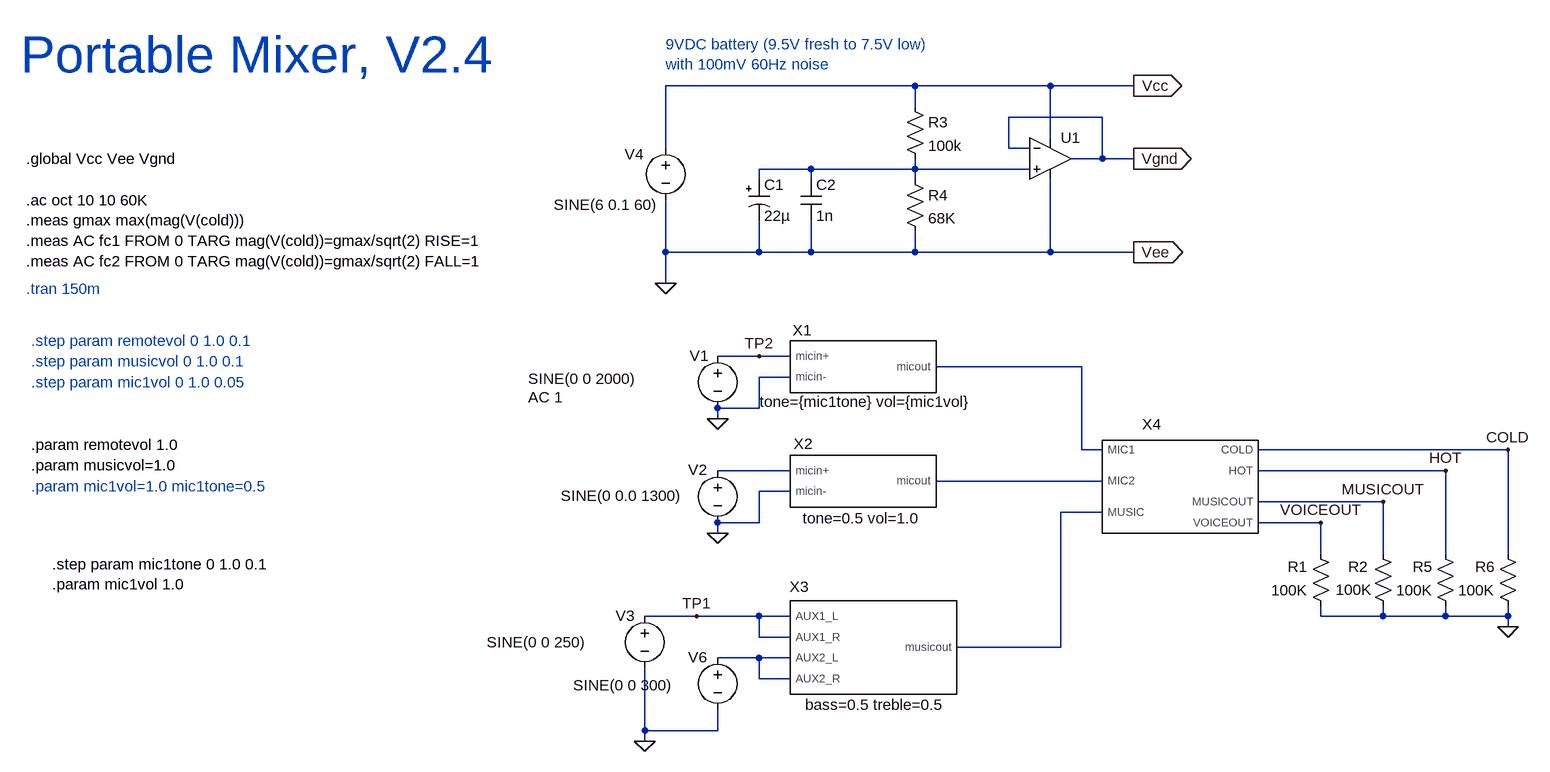
[diagram p0: schematic NewTopLevel_V2.4.asc]
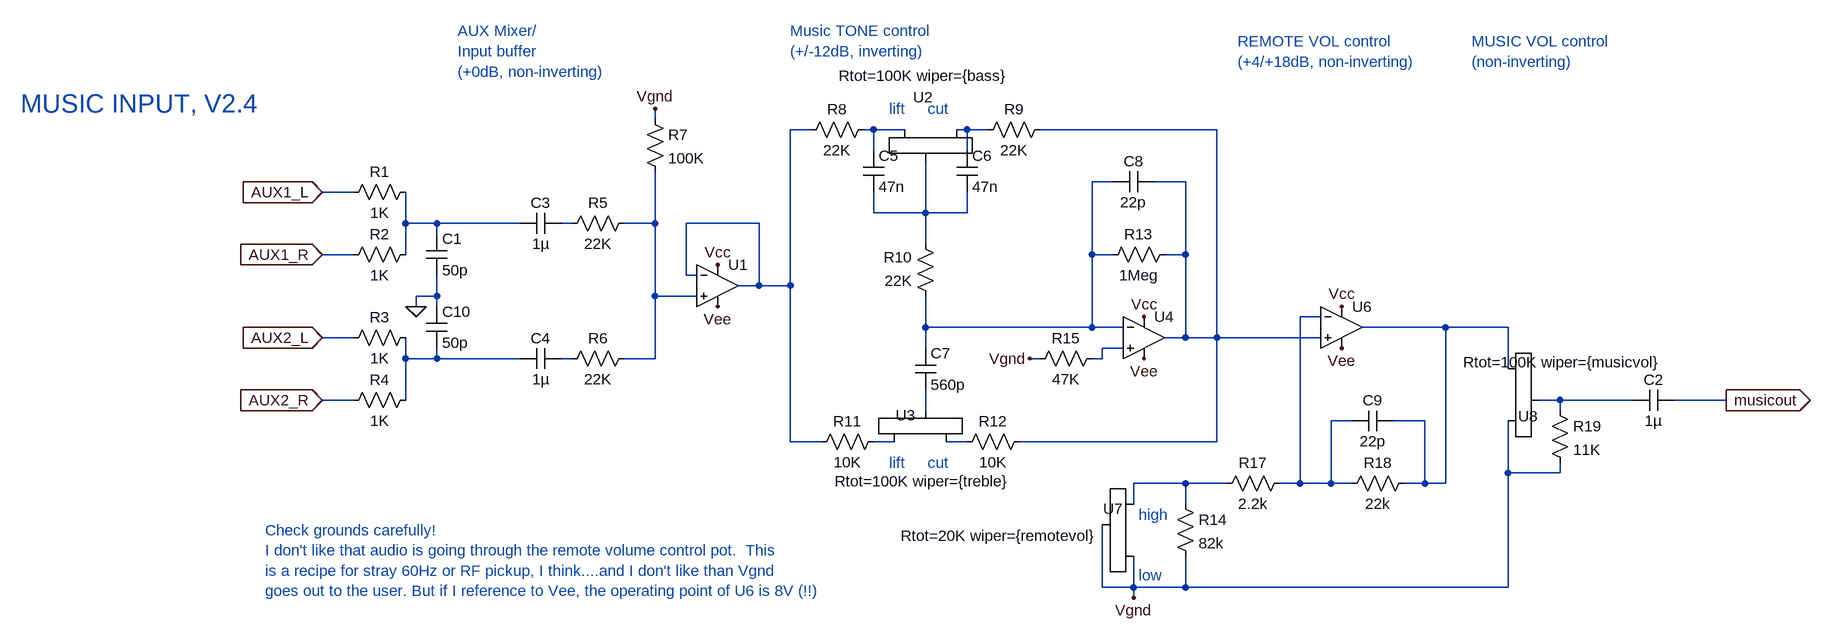
[diagram p1: sub-circuit newmusicinput_v2.4.asc]
NewTopLevel_V2.4.asc, the LTspice schematic file:
Version 4
SHEET 1 1264 812
WIRE 224 -256 -160 -256
WIRE 432 -256 224 -256
WIRE 560 -256 432 -256
WIRE 224 -224 224 -256
WIRE 512 -208 368 -208
WIRE 432 -176 432 -256
WIRE -160 -160 -160 -256
WIRE 368 -160 368 -208
WIRE 400 -160 368 -160
WIRE 512 -144 512 -208
WIRE 512 -144 464 -144
WIRE 560 -144 512 -144
WIRE 64 -128 -16 -128
WIRE 224 -128 224 -144
WIRE 224 -128 64 -128
WIRE 400 -128 224 -128
WIRE -16 -112 -16 -128
WIRE 64 -112 64 -128
WIRE 224 -112 224 -128
WIRE -160 0 -160 -80
WIRE -16 0 -16 -48
WIRE -16 0 -160 0
WIRE 64 0 64 -48
WIRE 64 0 -16 0
WIRE 224 0 224 -32
WIRE 224 0 64 0
WIRE 432 0 432 -112
WIRE 432 0 224 0
WIRE 560 0 432 0
WIRE -160 48 -160 0
WIRE -16 160 -80 160
WIRE 32 160 -16 160
WIRE 480 176 256 176
WIRE 32 192 -16 192
WIRE -16 240 -16 192
WIRE -16 240 -80 240
WIRE -80 256 -80 240
WIRE 480 304 480 176
WIRE 512 304 480 304
WIRE 1136 304 752 304
WIRE 32 336 -80 336
WIRE 1040 336 752 336
WIRE 512 352 256 352
WIRE 32 368 -16 368
WIRE 944 384 752 384
WIRE 512 400 448 400
WIRE -16 416 -16 368
WIRE -16 416 -80 416
WIRE 848 416 752 416
WIRE -80 432 -80 416
WIRE 848 464 848 416
WIRE 944 464 944 384
WIRE 1040 464 1040 336
WIRE 1136 464 1136 304
WIRE -112 560 -192 560
WIRE -16 560 -112 560
WIRE 32 560 -16 560
WIRE 848 560 848 544
WIRE 944 560 944 544
WIRE 944 560 848 560
WIRE 1040 560 1040 544
WIRE 1040 560 944 560
WIRE 1136 560 1136 544
WIRE 1136 560 1040 560
WIRE 1136 576 1136 560
WIRE -16 592 -16 560
WIRE 32 592 -16 592
WIRE 448 608 448 400
WIRE 448 608 288 608
WIRE -16 624 -80 624
WIRE 32 624 -16 624
WIRE -16 656 -16 624
WIRE 32 656 -16 656
WIRE -192 736 -192 640
WIRE -80 736 -80 704
WIRE -80 736 -192 736
WIRE -192 752 -192 736
FLAG -80 256 0
FLAG -80 432 0
FLAG 560 -144 Vgnd
IOPIN 560 -144 Out
FLAG 560 -256 Vcc
IOPIN 560 -256 Out
FLAG 560 0 Vee
IOPIN 560 0 Out
FLAG -160 48 0
FLAG -192 752 0
FLAG 1136 576 0
FLAG 1136 304 COLD
FLAG 1040 336 HOT
FLAG 944 384 MUSICOUT
FLAG 848 416 VOICEOUT
FLAG -112 560 TP1
FLAG -16 160 TP2
SYMBOL NewBalancedMicInput_V2.4 144 176 R0
WINDOW 0 -94 -40 Bottom 2
WINDOW 39 4 70 Bottom 2
SYMATTR InstName X1
SYMATTR SpiceLine tone={mic1tone} vol={mic1vol}
SYMBOL NewBalancedMicInput_V2.4 144 352 R0
WINDOW 0 -92 -42 Bottom 2
WINDOW 39 -3 73 Bottom 2
SYMATTR InstName X2
SYMATTR SpiceLine tone=0.5 vol=1.0
SYMBOL voltage -80 144 R0
WINDOW 0 -43 15 Left 2
WINDOW 3 -291 51 Left 2
WINDOW 123 -291 79 Left 2
WINDOW 39 0 0 Left 0
SYMATTR InstName V1
SYMATTR Value SINE(0 0 2000)
SYMATTR Value2 AC 1
SYMBOL voltage -80 320 R0
WINDOW 0 -45 15 Left 2
WINDOW 3 -241 55 Left 2
WINDOW 123 -241 83 Left 2
WINDOW 39 0 0 Left 0
SYMATTR InstName V2
SYMATTR Value SINE(0 0.0 1300)
SYMBOL UniversalOpamp 432 -144 R0
SYMATTR InstName U1
SYMATTR Value2 Avol=100K GBW=1.2Meg Vos=0
SYMBOL Res 208 -240 R0
SYMATTR InstName R3
SYMATTR Value 100k
SYMBOL Res 208 -128 R0
SYMATTR InstName R4
SYMATTR Value 68K
SYMBOL voltage -160 -176 R0
WINDOW 123 0 0 Left 0
WINDOW 39 0 0 Left 0
WINDOW 0 -63 25 Left 2
WINDOW 3 -172 103 Left 2
SYMATTR InstName V4
SYMATTR Value SINE(6 0.1 60)
SYMBOL Cap 48 -112 R0
SYMATTR InstName C2
SYMATTR Value 1n
SYMBOL polcap -32 -112 R0
SYMATTR InstName C1
SYMATTR Value 22µ
SYMBOL NewMusicInput_V2.4 160 608 R0
WINDOW 0 -114 -78 Bottom 2
WINDOW 39 2 104 Bottom 2
SYMATTR InstName X3
SYMATTR SpiceLine bass=0.5 treble=0.5
SYMBOL voltage -192 544 R0
WINDOW 0 -45 15 Left 2
WINDOW 3 -243 56 Left 2
WINDOW 123 -243 84 Left 2
WINDOW 39 0 0 Left 0
SYMATTR InstName V3
SYMATTR Value SINE(0 0 250)
SYMBOL voltage -80 608 R0
WINDOW 0 -45 15 Left 2
WINDOW 3 -222 58 Left 2
WINDOW 123 0 0 Left 0
WINDOW 39 0 0 Left 0
SYMATTR InstName V6
SYMATTR Value SINE(0 0 300)
SYMBOL NewFinalMixer_V2.4 624 352 R0
SYMATTR InstName X4
SYMBOL res 864 560 R180
WINDOW 0 36 76 Left 2
WINDOW 3 36 40 Left 2
SYMATTR InstName R1
SYMATTR Value 100K
SYMBOL res 928 448 R0
WINDOW 0 -38 36 Left 2
WINDOW 3 -57 71 Left 2
SYMATTR InstName R2
SYMATTR Value 100K
SYMBOL res 1056 560 R180
WINDOW 0 36 76 Left 2
WINDOW 3 36 40 Left 2
SYMATTR InstName R5
SYMATTR Value 100K
SYMBOL res 1152 560 R180
WINDOW 0 36 76 Left 2
WINDOW 3 36 40 Left 2
SYMATTR InstName R6
SYMATTR Value 100K
TEXT -1144 56 Left 2 ;.tran 150m
TEXT -160 -320 Left 2 ;9VDC battery (9.5V fresh to 7.5V low)\nwith 100mV 60Hz noise
TEXT -1152 -304 Left 6 ;Portable Mixer, V2.4
TEXT -1144 -80 Left 2 !.ac oct 10 10 60K\n.meas gmax max(mag(V(cold)))\n.meas AC fc1 FROM 0 TARG mag(V(cold))=gmax/sqrt(2) RISE=1\n.meas AC fc2 FROM 0 TARG mag(V(cold))=gmax/sqrt(2) FALL=1
TEXT -1136 168 Left 2 ;.step param musicvol 0 1.0 0.1
TEXT -1136 328 Left 2 !.param musicvol=1.0
TEXT -1136 136 Left 2 ;.step param remotevol 0 1.0 0.1
TEXT -1136 296 Left 2 !.param remotevol 1.0
TEXT -1144 -144 Left 2 !.global Vcc Vee Vgnd
TEXT -1136 200 Left 2 ;.step param mic1vol 0 1.0 0.05
TEXT -1136 360 Left 2 ;.param mic1vol=1.0 mic1tone=0.5
TEXT -1104 480 Left 2 !.step param mic1tone 0 1.0 0.1\n.param mic1vol 1.0

newmusicinput_v2.4.asc, the sub-circuit schematic file:
Version 4
SHEET 1 2328 872
WIRE 480 -32 480 -48
WIRE 720 -16 688 -16
WIRE 816 -16 800 -16
WIRE 864 -16 816 -16
WIRE 960 -16 944 -16
WIRE 992 -16 960 -16
WIRE 1344 -16 1072 -16
WIRE 816 16 816 -16
WIRE 960 16 960 -16
WIRE 1184 64 1152 64
WIRE 1296 64 1248 64
WIRE 16 80 -32 80
WIRE 816 112 816 80
WIRE 896 112 896 32
WIRE 896 112 816 112
WIRE 960 112 960 80
WIRE 960 112 896 112
WIRE 96 128 96 80
WIRE 144 128 96 128
WIRE 272 128 144 128
WIRE 352 128 336 128
WIRE 480 128 480 48
WIRE 480 128 432 128
WIRE 640 128 528 128
WIRE 144 144 144 128
WIRE 896 160 896 112
WIRE 16 176 -32 176
WIRE 96 176 96 128
WIRE 1152 176 1152 64
WIRE 1184 176 1152 176
WIRE 1296 176 1296 64
WIRE 1296 176 1264 176
WIRE 528 208 528 128
WIRE 544 208 528 208
WIRE 640 224 640 128
WIRE 640 224 608 224
WIRE 688 224 688 -16
WIRE 688 224 640 224
WIRE 144 240 144 208
WIRE 144 240 112 240
WIRE 480 240 480 128
WIRE 544 240 480 240
WIRE 112 256 112 240
WIRE 144 256 144 240
WIRE 1504 272 1472 272
WIRE 896 288 896 240
WIRE 1152 288 1152 176
WIRE 1152 288 896 288
WIRE 1200 288 1152 288
WIRE 1696 288 1568 288
WIRE 1792 288 1696 288
WIRE 16 304 -32 304
WIRE 1296 304 1296 176
WIRE 1296 304 1264 304
WIRE 1344 304 1344 -16
WIRE 1344 304 1296 304
WIRE 1504 304 1344 304
WIRE 896 320 896 288
WIRE 1200 320 1168 320
WIRE 96 336 96 304
WIRE 144 336 144 320
WIRE 144 336 96 336
WIRE 272 336 144 336
WIRE 352 336 336 336
WIRE 480 336 480 240
WIRE 480 336 432 336
WIRE 1072 336 1056 336
WIRE 1168 336 1168 320
WIRE 1168 336 1152 336
WIRE 1792 352 1792 288
WIRE 16 400 -32 400
WIRE 96 400 96 336
WIRE 1872 400 1840 400
WIRE 1984 400 1872 400
WIRE 2128 400 2048 400
WIRE 896 416 896 384
WIRE 1872 416 1872 400
WIRE 1552 432 1520 432
WIRE 1664 432 1616 432
WIRE 688 464 688 224
WIRE 736 464 688 464
WIRE 848 464 816 464
WIRE 960 464 928 464
WIRE 1344 464 1344 304
WIRE 1344 464 1040 464
WIRE 1792 512 1792 432
WIRE 1872 512 1872 496
WIRE 1872 512 1792 512
WIRE 1296 528 1216 528
WIRE 1360 528 1296 528
WIRE 1472 528 1472 272
WIRE 1472 528 1440 528
WIRE 1520 528 1520 432
WIRE 1520 528 1472 528
WIRE 1552 528 1520 528
WIRE 1664 528 1664 432
WIRE 1664 528 1632 528
WIRE 1696 528 1696 288
WIRE 1696 528 1664 528
WIRE 1216 560 1216 528
WIRE 1296 560 1296 528
WIRE 1168 688 1168 592
WIRE 1216 688 1216 640
WIRE 1216 688 1168 688
WIRE 1296 688 1296 640
WIRE 1296 688 1216 688
WIRE 1792 688 1792 512
WIRE 1792 688 1296 688
WIRE 1216 704 1216 688
FLAG 576 192 Vcc
FLAG 1232 272 Vcc
FLAG 576 256 Vee
FLAG 1232 336 Vee
FLAG 1536 256 Vcc
FLAG 1536 320 Vee
FLAG 2128 400 musicout
IOPIN 2128 400 Out
FLAG -32 80 AUX1_L
IOPIN -32 80 In
FLAG -32 176 AUX1_R
IOPIN -32 176 In
FLAG -32 304 AUX2_L
IOPIN -32 304 In
FLAG -32 400 AUX2_R
IOPIN -32 400 In
FLAG 480 -48 Vgnd
FLAG 1056 336 Vgnd
FLAG 112 256 0
FLAG 1216 704 Vgnd
SYMBOL res 112 64 R90
WINDOW 0 0 56 VBottom 2
WINDOW 3 32 56 VTop 2
SYMATTR InstName R1
SYMATTR Value 1K
SYMBOL res 112 160 R90
WINDOW 0 0 56 VBottom 2
WINDOW 3 32 56 VTop 2
SYMATTR InstName R2
SYMATTR Value 1K
SYMBOL res 112 288 R90
WINDOW 0 0 56 VBottom 2
WINDOW 3 32 56 VTop 2
SYMATTR InstName R3
SYMATTR Value 1K
SYMBOL res 112 384 R90
WINDOW 0 0 56 VBottom 2
WINDOW 3 32 56 VTop 2
SYMATTR InstName R4
SYMATTR Value 1K
SYMBOL cap 128 144 R0
SYMATTR InstName C1
SYMATTR Value 50p
SYMBOL cap 336 112 R90
WINDOW 0 0 32 VBottom 2
WINDOW 3 32 32 VTop 2
SYMATTR InstName C3
SYMATTR Value 1µ
SYMBOL cap 336 320 R90
WINDOW 0 0 32 VBottom 2
WINDOW 3 32 32 VTop 2
SYMATTR InstName C4
SYMATTR Value 1µ
SYMBOL res 448 112 R90
WINDOW 0 0 56 VBottom 2
WINDOW 3 32 56 VTop 2
SYMATTR InstName R5
SYMATTR Value 22K
SYMBOL res 448 320 R90
WINDOW 0 0 56 VBottom 2
WINDOW 3 32 56 VTop 2
SYMATTR InstName R6
SYMATTR Value 22K
SYMBOL res 464 -48 R0
SYMATTR InstName R7
SYMATTR Value 100K
SYMBOL potentiometer_standard 960 -32 R90
WINDOW 0 -34 52 VRight 2
WINDOW 3 -67 -63 VRight 2
WINDOW 39 -72 -23 Invisible 2
WINDOW 38 48 41 Invisible 2
SYMATTR InstName U2
SYMATTR Value Rtot=100K wiper={bass}
SYMBOL potentiometer_standard 832 480 R270
WINDOW 0 57 18 VRight 2
WINDOW 3 -45 -76 VRight 2
WINDOW 39 -72 -23 Invisible 2
WINDOW 38 48 41 Invisible 2
SYMATTR InstName U3
SYMATTR Value Rtot=100K wiper={treble}
SYMBOL res 816 -32 R90
WINDOW 0 0 56 VBottom 2
WINDOW 3 32 56 VTop 2
SYMATTR InstName R8
SYMATTR Value 22K
SYMBOL res 1088 -32 R90
WINDOW 0 0 56 VBottom 2
WINDOW 3 32 56 VTop 2
SYMATTR InstName R9
SYMATTR Value 22K
SYMBOL res 912 256 R180
WINDOW 0 36 76 Left 2
WINDOW 3 36 40 Left 2
SYMATTR InstName R10
SYMATTR Value 22K
SYMBOL res 720 480 R270
WINDOW 0 32 56 VTop 2
WINDOW 3 0 56 VBottom 2
SYMATTR InstName R11
SYMATTR Value 10K
SYMBOL res 944 480 R270
WINDOW 0 32 56 VTop 2
WINDOW 3 0 56 VBottom 2
SYMATTR InstName R12
SYMATTR Value 10K
SYMBOL res 1168 192 R270
WINDOW 0 32 56 VTop 2
WINDOW 3 0 56 VBottom 2
SYMATTR InstName R13
SYMATTR Value 1Meg
SYMBOL cap 800 16 R0
SYMATTR InstName C5
SYMATTR Value 47n
SYMBOL cap 944 16 R0
SYMATTR InstName C6
SYMATTR Value 47n
SYMBOL cap 880 320 R0
SYMATTR InstName C7
SYMATTR Value 560p
SYMBOL cap 1248 48 R90
WINDOW 0 0 32 VBottom 2
WINDOW 3 32 32 VTop 2
SYMATTR InstName C8
SYMATTR Value 22p
SYMBOL Opamps/UniversalOpAmp 576 224 R0
SYMATTR InstName U1
SYMATTR Value2 Avol=100K GBW=1Meg Vos=0
SYMBOL Opamps/UniversalOpAmp 1232 304 R0
SYMATTR InstName U4
SYMATTR Value2 Avol=100K GBW=1Meg Vos=0
SYMBOL cap 128 256 R0
SYMATTR InstName C10
SYMATTR Value 50p
SYMBOL Opamps/UniversalOpAmp 1536 288 R0
SYMATTR InstName U6
SYMATTR Value2 Avol=100K GBW=1Meg Vos=0
SYMBOL res 1280 544 R0
SYMATTR InstName R14
SYMATTR Value 82k
SYMBOL res 1456 512 R90
WINDOW 0 0 56 VBottom 2
WINDOW 3 32 56 VTop 2
SYMATTR InstName R17
SYMATTR Value 2.2k
SYMBOL res 1648 512 R90
WINDOW 0 0 56 VBottom 2
WINDOW 3 32 56 VTop 2
SYMATTR InstName R18
SYMATTR Value 22k
SYMBOL cap 1616 416 R90
WINDOW 0 0 32 VBottom 2
WINDOW 3 32 32 VTop 2
SYMATTR InstName C9
SYMATTR Value 22p
SYMBOL potentiometer_standard 1232 656 R180
WINDOW 0 32 89 Left 2
WINDOW 3 71 47 Left 2
WINDOW 39 48 112 Invisible 2
WINDOW 38 48 41 Invisible 2
SYMATTR InstName U7
SYMATTR Value Rtot=20K wiper={remotevol}
SYMBOL potentiometer_standard 1776 336 R0
WINDOW 0 32 89 Left 2
WINDOW 3 -53 6 Left 2
WINDOW 39 48 112 Invisible 2
WINDOW 38 48 41 Invisible 2
SYMATTR InstName U8
SYMATTR Value Rtot=100K wiper={musicvol}
SYMBOL res 1856 400 R0
SYMATTR InstName R19
SYMATTR Value 11K
SYMBOL cap 2048 384 R90
WINDOW 0 0 32 VBottom 2
WINDOW 3 32 32 VTop 2
SYMATTR InstName C2
SYMATTR Value 1µ
SYMBOL res 1168 320 R90
WINDOW 0 0 56 VBottom 2
WINDOW 3 32 56 VTop 2
SYMATTR InstName R15
SYMATTR Value 47K
TEXT 840 -48 Left 2 ;lift     cut
TEXT 840 496 Left 2 ;lift     cut
TEXT 688 -168 Left 2 ;Music TONE control\n(+/-12dB, inverting)
TEXT 176 -168 Left 2 ;AUX Mixer/\nInput buffer\n(+0dB, non-inverting)
TEXT 1376 -152 Left 2 ;REMOTE VOL control\n(+4/+18dB, non-inverting)
TEXT -120 600 Left 2 ;Check grounds carefully!\nI don't like that audio is going through the remote volume control pot.  This \nis a recipe for stray 60Hz or RF pickup, I think....and I don't like than Vgnd\ngoes out to the user. But if I reference to Vee, the operating point of U6 is 8V (!!)
TEXT 1736 -152 Left 2 ;MUSIC VOL control\n(non-inverting)
TEXT 1224 576 Left 2 ;high\n \n\nlow
TEXT -496 -56 Left 4 ;MUSIC INPUT, V2.4

The netlist it stands for:
* NewTopLevel_V2.4.asc
XX1 TP2 0 N002 NewBalancedMicInput_V2.4 params: tone={mic1tone} vol={mic1vol}  ; pins micin+ micin- micout
XX2 N003 0 N004 NewBalancedMicInput_V2.4 params: tone=0.5 vol=1.0  ; pins micin+ micin- micout
V1 TP2 0 SINE(0 0 2000) AC 1
V2 N003 0 SINE(0 0.0 1300)
XU1 N001 Vgnd Vcc 0 Vgnd level1 Avol=100K GBW=1.2Meg Vos=0 En=0 Enk=0 In=0 Ink=0 Rin=500Meg  ; pins In+ In- V+ V- OUT
R3 Vcc N001 100k
R4 N001 0 68K
V4 Vcc 0 SINE(6 0.1 60)
C2 N001 0 1n
C1 N001 0 22µ
XX3 TP1 TP1 N006 N006 N005 newmusicinput_v2.4 params: bass=0.5 treble=0.5
V3 TP1 0 SINE(0 0 250)
V6 N006 0 SINE(0 0 300)
XX4 N002 N004 N005 COLD HOT MUSICOUT VOICEOUT NewFinalMixer_V2.4  ; pins MIC1 MIC2 MUSIC COLD HOT MUSICOUT VOICEOUT
R1 0 VOICEOUT 100K
R2 MUSICOUT 0 100K
R5 0 HOT 100K
R6 0 COLD 100K

* block symbol definitions
.subckt newmusicinput_v2.4 AUX1_L AUX1_R AUX2_L AUX2_R musicout
R1 N007 AUX1_L 1K
R2 N007 AUX1_R 1K
R3 N013 AUX2_L 1K
R4 N013 AUX2_R 1K
C1 N007 0 50p
C3 N008 N007 1µ
C4 N014 N013 1µ
R5 N009 N008 22K
R6 N009 N014 22K
R7 Vgnd N009 100K
XU2 N003 N002 N006 Rtot=100K wiper={bass}
XU3 N017 N018 N016 Rtot=100K wiper={treble}
R8 N002 N001 22K
R9 N004 N003 22K
R10 N005 N006 22K
R11 N001 N017 10K
R12 N018 N004 10K
R13 N005 N004 1Meg
C5 N002 N006 47n
C6 N003 N006 47n
C7 N005 N016 560p
C8 N004 N005 22p
XU1 N009 N001 Vcc Vee N001 level1 Avol=100K GBW=1Meg Vos=0 En=0 Enk=0 In=0 Ink=0 Rin=500Meg  ; pins In+ In- V+ V- OUT
XU4 N012 N005 Vcc Vee N004 level1 Avol=100K GBW=1Meg Vos=0 En=0 Enk=0 In=0 Ink=0 Rin=500Meg  ; pins In+ In- V+ V- OUT
C10 0 N013 50p
XU6 N004 N010 Vcc Vee N011 level1 Avol=100K GBW=1Meg Vos=0 En=0 Enk=0 In=0 Ink=0 Rin=500Meg  ; pins In+ In- V+ V- OUT
R14 N019 Vgnd 82k
R17 N010 N019 2.2k
R18 N011 N010 22k
C9 N011 N010 22p
XU7 Vgnd N019 Vgnd Rtot=20K wiper={remotevol}
XU8 N011 Vgnd N015 Rtot=100K wiper={musicvol}
R19 N015 Vgnd 11K
C2 musicout N015 1µ
R15 N012 Vgnd 47K
* lift     cut
* lift     cut
* Music TONE control
* (+/-12dB, inverting)
* AUX Mixer/
* Input buffer
* (+0dB, non-inverting)
* REMOTE VOL control
* (+4/+18dB, non-inverting)
* Check grounds carefully!
* I don't like that audio is going through the remote volume control pot.  This
* is a recipe for stray 60Hz or RF pickup, I think....and I don't like than Vgnd
* goes out to the user. But if I reference to Vee, the operating point of U6 is 8V (!!)
* MUSIC VOL control
* (non-inverting)
* high
* low
* MUSIC INPUT, V2.4
.ends newmusicinput_v2.4

* .tran 150m
* 9VDC battery (9.5V fresh to 7.5V low)
* with 100mV 60Hz noise
* Portable Mixer, V2.4
.ac oct 10 10 60K
.meas gmax max(mag(V(cold)))
.meas AC fc1 FROM 0 TARG mag(V(cold))=gmax/sqrt(2) RISE=1
.meas AC fc2 FROM 0 TARG mag(V(cold))=gmax/sqrt(2) FALL=1
* .step param musicvol 0 1.0 0.1
.param musicvol=1.0
* .step param remotevol 0 1.0 0.1
.param remotevol 1.0
.global Vcc Vee Vgnd
* .step param mic1vol 0 1.0 0.05
* .param mic1vol=1.0 mic1tone=0.5
.step param mic1tone 0 1.0 0.1
.param mic1vol 1.0
.lib UniversalOpAmp1.lib
.backanno
.end